# Altium schematic sheet Memory.SchDoc
size 220 x 165 mm
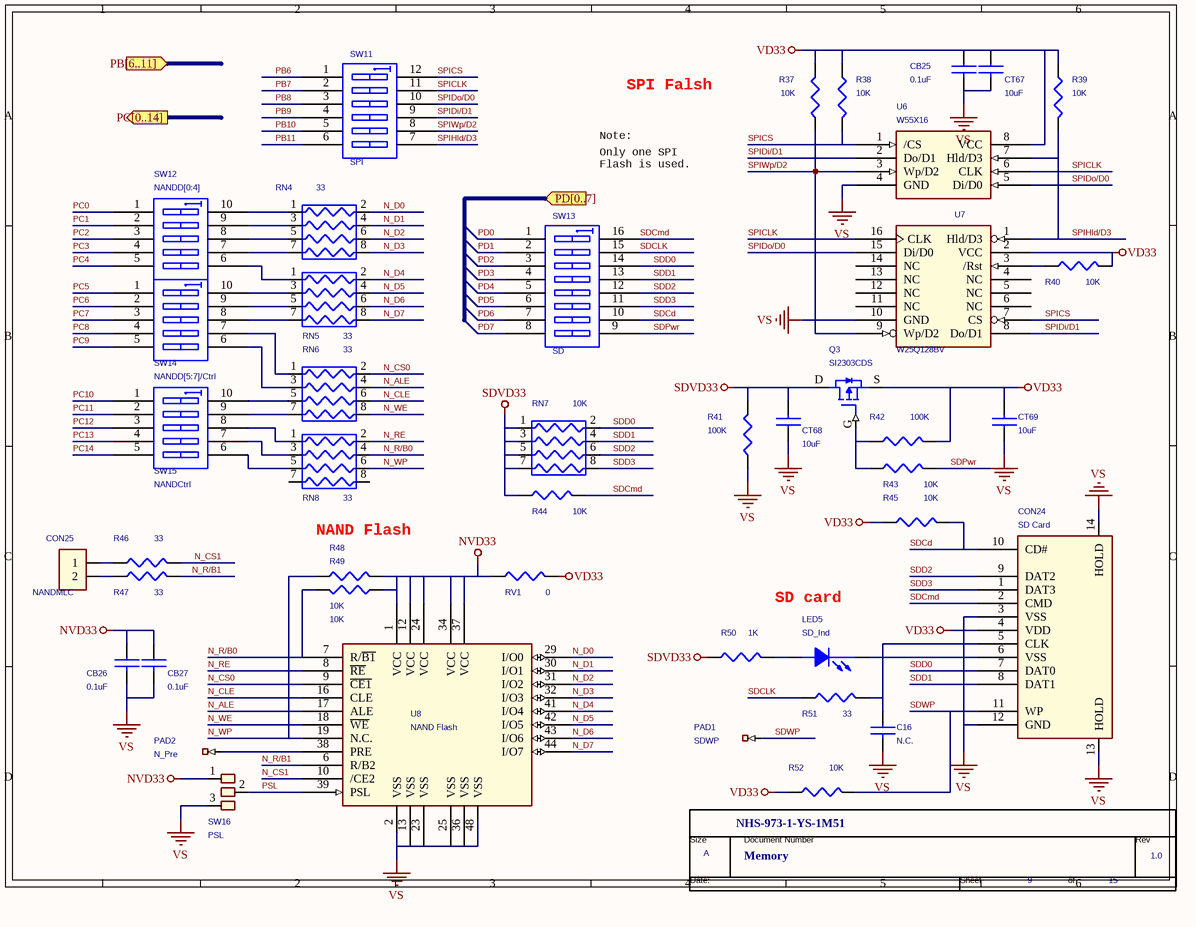
[diagram p0: Memory.SchDoc]

## Parts
*  RevCode: 1.0  Page Size: A  Page Number: 9  Page Count: 15  Doc: Memory  OrgName: NHS-973-1-YS-1M51  (hidden comment: TitleBlock0N)  (graphical)
C16  N.C.  [C0603]
CB25  0.1uF  [C0603]
CB26  0.1uF  [C0603]
CB27  0.1uF  [C0603]
CON24  SD Card  [AXA2R63061]
CON25  NANDMLC  [Header_2x1_2.54mm]
CT67  10uF  [C0603]
CT68  10uF  [C0603]
CT69  10uF  [C0603]
LED5  SD_Ind  [LED_0603]
PAD1  SDWP  [1PAD 1.25x1.25mm]
PAD2  N_Pre  [1PAD 1.25x1.25mm]
Q3  SI2303CDS  [SOT-23]
R37  10K  [R0603]
R38  10K  [R0603]
R39  10K  [R0603]
R40  10K  [R0603]
R41  100K  [R0603]
R42  100K  [R0603]
R43  10K  [R0603]
R44  10K  [R0603]
R45  10K  [R0603]
R46  33  [R0603]
R47  33  [R0603]
R48  10K  [R0603]
R49  10K  [R0603]
R50  1K  [R0603]
R51  33  [R0603]
R52  10K  [R0603]
RN4  33  [8P4RA]
RN5  33  [8P4RA]
RN6  33  [8P4RA]
RN7  10K  [8P4RA]
RN8  33  [8P4RA]
RV1  0  [R0603]
SW11  SPI  [DIPSWx6_2.54mm]
SW12  NANDD[0:4]  [DIPSWx5_2.54mm]
SW13  SD  [DIPSWx8_2.54mm]
SW14  NANDD[5:7]/Ctrl  [DIPSWx5_2.54mm]
SW15  NANDCtrl  [DIPSWx5_2.54mm]
SW16  PSL  [3P-1.2mm]
U6  W55X16  [8-pin SOIC 150mil]
U7  W25Q128BV  [SOIC16_300]
U8  NAND Flash  [SOP48-0.5mm]

## Ports
PB[6..11] (in), PC[0..14] (out), PD[0..7] (in)

## Nets
NVD33: CB26.1 CB27.1 R48.2 R49.2 RV1.2 SW16.1(\) U8.1(VCC) U8.12(VCC) U8.24(VCC) U8.34(VCC) U8.37(VCC)
SDVD33: CT68.2 Q3.D(DRAIN) R41.2 R44.2 R50.1 RN7.1(R1) RN7.3(R2) RN7.5(R3) RN7.7(R4)
VD33: CB25.1 CON24.4(VDD) CT67.1 CT69.2 Q3.S(SOURCE) R37.2 R38.2 R39.2 R40.1 R42.2 R45.2 R52.2 RV1.1 U6.8(VCC) U7.2(VCC)
VS: C16.2 CB25.2 CB26.2 CB27.2 CON24.3(VSS) CON24.12(GND) CON24.13(HOLD) CON24.14(HOLD) CT67.2 CT68.1 CT69.1 R41.1 SW16.3(\) U6.4(GND) U7.10(GND) U8.2(VSS) U8.13(VSS) U8.23(VSS) U8.25(VSS) U8.36(VSS) U8.48(VSS)
N_ALE: RN6.4(R2) U8.17(ALE)
N_CLE: RN6.6(R3) U8.16(CLE)
N_CS0: RN6.2(R1) U8.9(~{CE1})
N_CS1: R46.2 U8.10(/CE2)
N_D0: RN4.2(R1) U8.29(I/O0)
N_D1: RN4.4(R2) U8.30(I/O1)
N_D2: RN4.6(R3) U8.31(I/O2)
N_D3: RN4.8(R4) U8.32(I/O3)
N_D4: RN5.2(R1) U8.41(I/O4)
N_D5: RN5.4(R2) U8.42(I/O5)
N_D6: RN5.6(R3) U8.43(I/O6)
N_D7: RN5.8(R4) U8.44(I/O7)
N_R/B0: R49.1 RN8.4(R2) U8.7(R/~{B1})
N_R/B1: R47.2 U8.6(R/B2)
N_RE: RN8.2(R1) U8.8(~{RE})
N_WE: RN6.8(R4) U8.18(~{WE})
N_WP: R48.1 RN8.6(R3) U8.19(N.C.)
PB6: SW11.1(A1)
PB7: SW11.2(A2)
PB8: SW11.3(A3)
PB9: SW11.4(A4)
PB10: SW11.5(A5)
PB11: SW11.6(A6)
PC0: SW12.1(A1)
PC1: SW12.2(A2)
PC2: SW12.3(A3)
PC3: SW12.4(A4)
PC4: SW12.5(A5)
PC5: SW14.1(A1)
PC6: SW14.2(A2)
PC7: SW14.3(A3)
PC8: SW14.4(A4)
PC9: SW14.5(A5)
PC10: SW15.1(A1)
PC11: SW15.2(A2)
PC12: SW15.3(A3)
PC13: SW15.4(A4)
PC14: SW15.5(A5)
PD0: SW13.1(A1)
PD1: SW13.2(A2)
PD2: SW13.3(A3)
PD3: SW13.4(A4)
PD4: SW13.5(A5)
PD5: SW13.6(A6)
PD6: SW13.7(A7)
PD7: SW13.8(A8)
PSL: SW16.2(\) U8.39(PSL)
SDCd: CON24.10(CD#) R45.1 SW13.10(B7)
SDCLK: R51.2 SW13.15(B2)
SDCmd: CON24.2(CMD) R44.1 SW13.16(B1)
SDD0: CON24.7(DAT0) RN7.2(R1) SW13.14(B3)
SDD1: CON24.8(DAT1) RN7.4(R2) SW13.13(B4)
SDD2: CON24.9(DAT2) RN7.6(R3) SW13.12(B5)
SDD3: CON24.1(DAT3) RN7.8(R4) SW13.11(B6)
SDPwr: R43.1 SW13.9(B8)
SDWP: CON24.11(WP) PAD1.\ R52.1
SPICLK: SW11.11(B2) U6.6(CLK) U7.16(CLK)
SPICS: R38.1 SW11.12(B1) U6.1(/CS) U7.7(CS)
SPIDi/D1: SW11.9(B4) U6.2(Do/D1) U7.8(Do/D1)
SPIDo/D0: SW11.10(B3) U6.5(Di/D0) U7.15(Di/D0)
SPIHld/D3: R39.1 SW11.7(B6) U6.7(Hld/D3) U7.1(Hld/D3)
SPIWp/D2: R37.1 SW11.8(B5) U6.3(Wp/D2) U7.9(Wp/D2)
NetC16_1: C16.1 CON24.5(CLK) R51.1
NetCON24_6: CON24.6(VSS) LED5.2(CATHODE)
NetCON25_1: CON25.1 R46.1
NetCON25_2: CON25.2 R47.1
NetLED5_1: LED5.1(ANODE) R50.2
NetPAD2~{_}: PAD2.\ U8.38(PRE)
NetQ3_G: Q3.G(GATE) R42.1 R43.2
NetR40_2: R40.2 U7.3(/Rst)
NetRN4_1: RN4.1(R1) SW12.10(B1)
NetRN4_3: RN4.3(R2) SW12.9(B2)
NetRN4_5: RN4.5(R3) SW12.8(B3)
NetRN4_7: RN4.7(R4) SW12.7(B4)
NetRN5_1: RN5.1(R1) SW12.6(B5)
NetRN5_3: RN5.3(R2) SW14.10(B1)
NetRN5_5: RN5.5(R3) SW14.9(B2)
NetRN5_7: RN5.7(R4) SW14.8(B3)
NetRN6_1: RN6.1(R1) SW14.7(B4)
NetRN6_3: RN6.3(R2) SW14.6(B5)
NetRN6_5: RN6.5(R3) SW15.10(B1)
NetRN6_7: RN6.7(R4) SW15.9(B2)
NetRN8_1: RN8.1(R1) SW15.8(B3)
NetRN8_3: RN8.3(R2) SW15.7(B4)
NetRN8_5: RN8.5(R3) SW15.6(B5)

Not connected (* = marked no-connect by the designer): RN8 7(R4) 8(R4); U7 4(NC) 5(NC) 6(NC) 11(NC) 12(NC) 13(NC) 14(NC)

## Notes on the sheet
- SPI Falsh
- Only one SPI
  Flash is used.
- Note:
- NAND Flash
- SD card
- (in symbol TitleBlock0N) Size; Document Number; Rev; Date:; Sheet; of

## Library data of the parts
C16 CB25-CB27 CT67-CT69 = CAP NP
CON24 = AXA2R63061_1
CON25 = CON2
LED5 = LED
PAD1 PAD2 = 1PAD
Q3 = SI2303CDS_1
R37-R52 RV1 = R
RN4-RN8 = R-PACK8_0: Package: 8P4RA
SW11 = SW DIP-6
SW12 SW14 SW15 = SW DIP-5
SW13 = SW DIP-8
SW16 = SW-3PAD2
U6 = W55X10_2
U7 = W25Q128BV_4
U8 = NAND 4-8G_0
* = TitleBlock0N: Page Create Date: April 25, 1995